# Altium schematic sheet схема платы контроллера.SchDoc
size A3
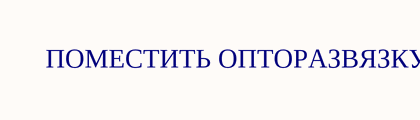
[diagram p0: схема платы контроллера.SchDoc]

## Notes on the sheet
- ПОМЕСТИТЬ ОПТОРАЗВЯЗКУ